# EAGLE design kicik-down (EAGLE 7.2.0)
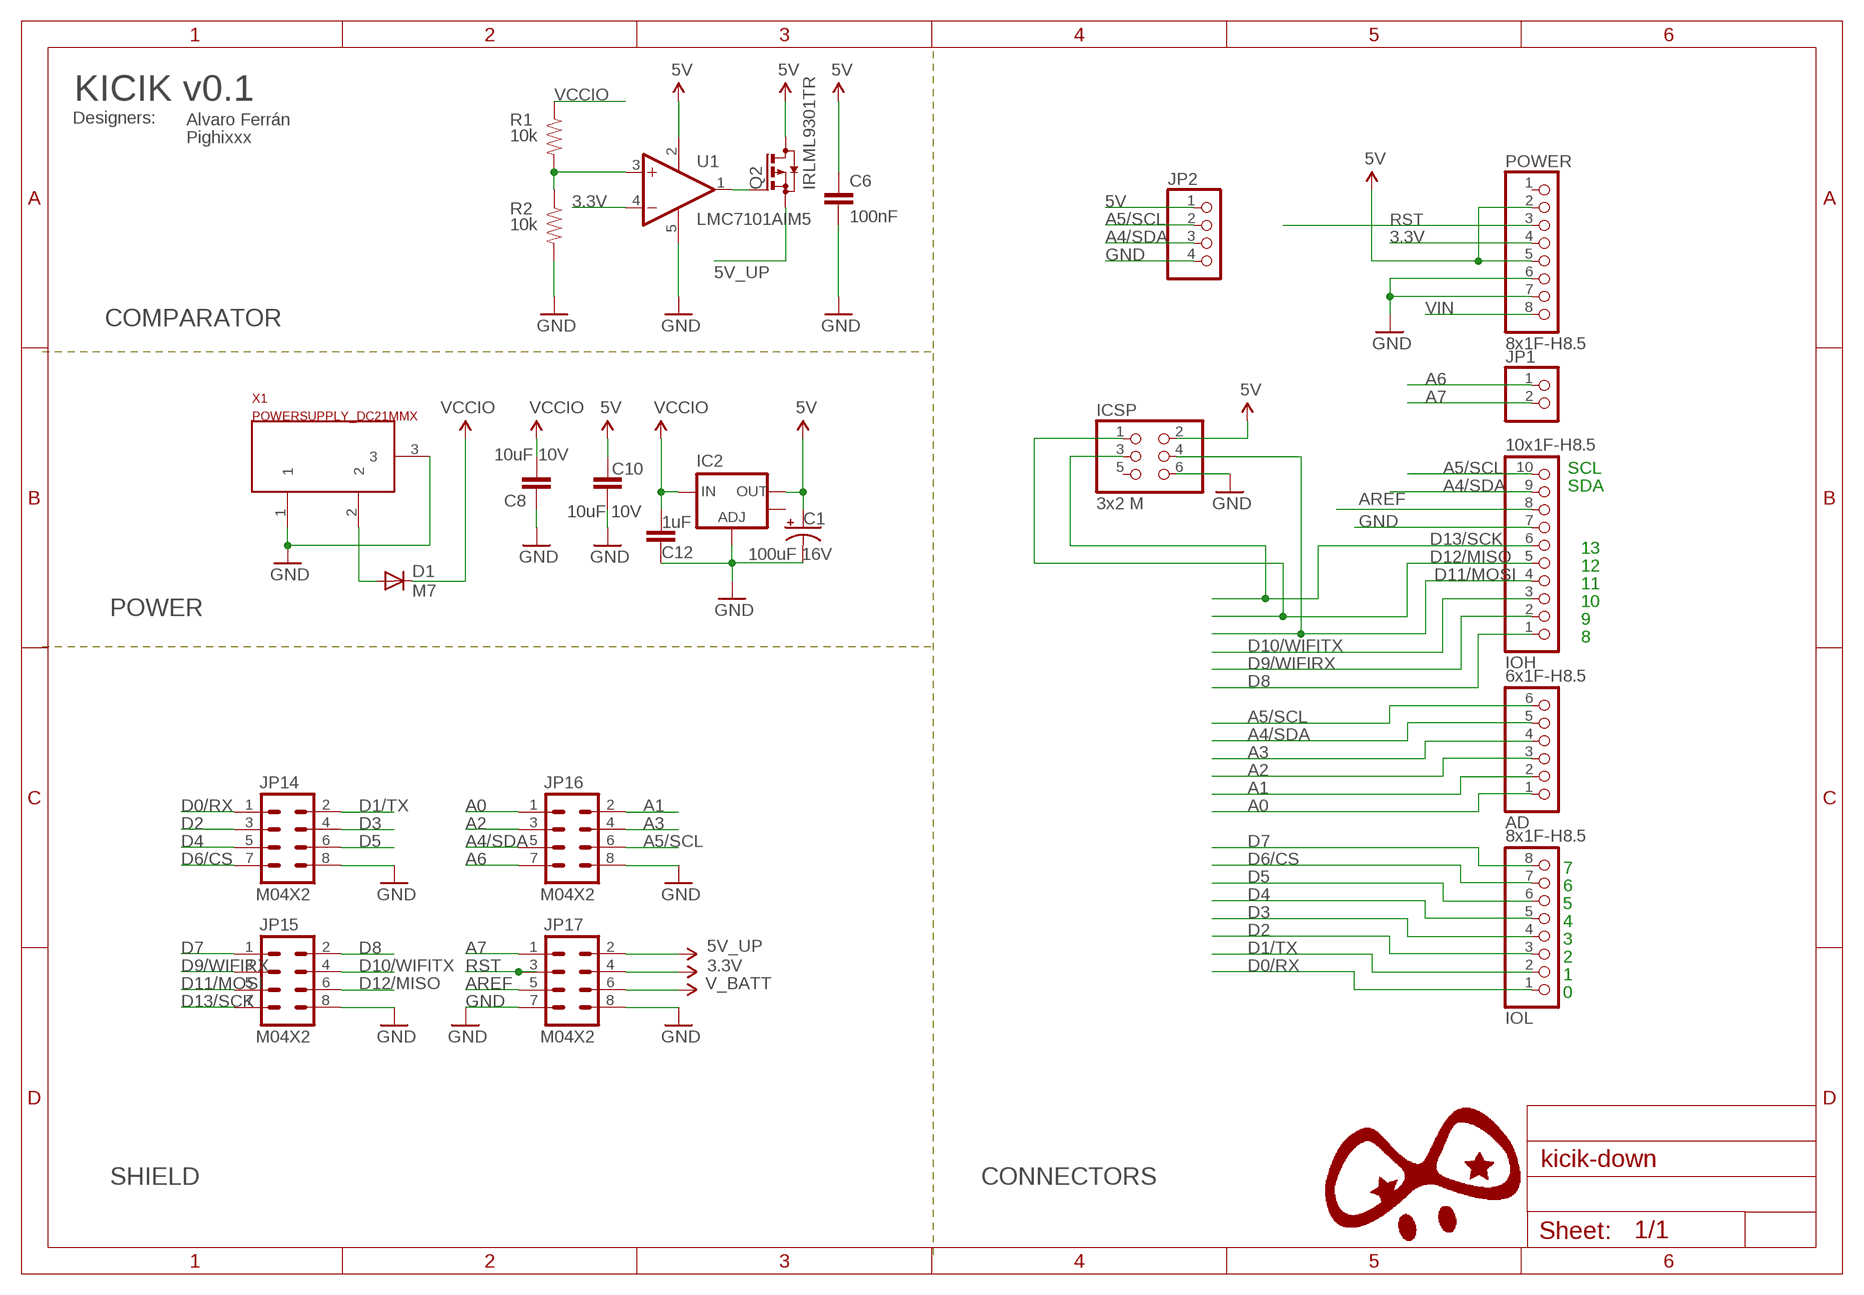
[diagram p0: schematic, sheet 1]

## Parts
AD  6x1F-H8.5  PINHD-1X6  [1X06]
C1  100uF 16V  CAP_POLC  [PANASONIC_C]
C6  100nF  CAP0402-CAP  [0402-CAP]
C8  10uF 10V  CAP0402-CAP  [0402-CAP]
C10  10uF 10V  CAP0402-CAP  [0402-CAP]
C12  1uF  CAP0402-CAP  [0402-CAP]
D1  M7  DIODE-SMB  [SMB]
IC2  V_REG_LM1117SOT223  [SOT223]
ICSP  3x2 M  PINHD-2X3  [2X03]
IOH  10x1F-H8.5  PINHD-1X10  [1X10]
IOL  8x1F-H8.5  PINHD-1X8  [1X08]
JP1  PINHD-1X2  [1X02]
JP2  PINHD-1X4  [1X04]
JP14  M04X2  [2X4]
JP15  M04X2  [2X4]
JP16  M04X2  [2X4]
JP17  M04X2  [2X4]
POWER  8x1F-H8.5  PINHD-1X8  [1X08]
Q2  IRLML9301TR  BSS84  [SOT23]
R1  10k  RESISTOR0402-RES  [0402-RES]
R2  10k  RESISTOR0402-RES  [0402-RES]
U1  LMC7101AIM5  [SOT23-5]
X1  POWERSUPPLY_DC21MMX  [POWERSUPPLY_DC-21MM]

## Nets
3.3V: JP17.4 POWER.4 U1.4(-IN)
5V: C1.+ C6.1 C10.2 IC2.2(OUT) ICSP.2 JP2.1 POWER.2 POWER.5 Q2.3(D) U1.2(V+)
5V_UP: JP17.2 Q2.2(S) ; supply symbol labelled VCC
A0: AD.1 JP16.1
A1: AD.2 JP16.2
A2: AD.3 JP16.3
A3: AD.4 JP16.4
A4/SDA: AD.5 IOH.9 JP2.3 JP16.5
A5/SCL: AD.6 IOH.10 JP2.2 JP16.6
A6: JP1.1 JP16.7
A7: JP1.2 JP17.1
AREF [aref]: IOH.8 JP17.5
D0/RX: IOL.1 JP14.1
D1/TX: IOL.2 JP14.2
D2: IOL.3 JP14.3
D3: IOL.4 JP14.4
D4: IOL.5 JP14.5
D5: IOL.6 JP14.6
D6/CS: IOL.7 JP14.7
D7: IOL.8 JP15.1
D8: IOH.1 JP15.2
D9/WIFIRX: IOH.2 JP15.3
D10/WIFITX: IOH.3 JP15.4
D11/MOSI: ICSP.4 IOH.4 JP15.5
D12/MISO: ICSP.1 IOH.5 JP15.6
D13/SCK: ICSP.3 IOH.6 JP15.7
GND [gnd]: C1.- C6.2 C8.1 C10.1 C12.1 IC2.1(ADJ) ICSP.6 IOH.7 JP2.4 JP14.8 JP15.8 JP16.8 JP17.7 JP17.8 POWER.6 POWER.7 R2.2 U1.5(V-) X1.1 X1.3
N$4: D1.A X1.2
N$5: Q2.1(G) U1.1(OUT)
N$6: R1.2 R2.1 U1.3(+IN)
RST: JP17.3 POWER.3
V_BATT: JP17.6
VCCIO [power]: C8.2 C12.2 D1.C IC2.3(IN) R1.1
VIN [power]: POWER.8
Unconnected: IC2.4(OUT) ICSP.5 POWER.1

## Notes on the sheet
- KICIK v0.1
- Designers: | Alvaro Ferrán
- Pighixxx
- COMPARATOR
- SCL
- SDA
- 13
- 12
- 11
- 10
- POWER
- 9
- 8
- 7
- 6
- 5
- 4
- 3
- 5V_UP
- 2
- 1
- 0
- SHIELD | CONNECTORS

## Library data of the parts
AD = SmartPrj:PINHD-1X6: PIN HEADER
C1 = SparkFun-Capacitors:CAP_POL: Capacitor Polarized These are standard SMD and PTH capacitors. Normally 10uF, 47uF, and 100uF in electrolytic and tantalum varieties. Always verify the external diameter of the through hole cap, it varies with capacity, voltage, and manufacturer. The EIA devices should be standard.
C6 C8 C10 C12 = SparkFun-Passives:CAP: Capacitor Standard 0603 ceramic capacitor, and 0.1" leaded capacitor.
D1 = diode:DIODE-: DIODE
IC2 = SparkFun-PowerIC:V_REG_LM1117: Voltage Regulator LM1117 Standard adjustable voltage regulator but in SMD form. Spark Fun Electronics SKU : COM-00595; PROD_ID: VREG-08170
ICSP = SmartPrj:PINHD-2X3: PIN HEADER
IOH = pinhead:PINHD-1X10: PIN HEADER
IOL POWER = SmartPrj:PINHD-1X8: PIN HEADER
JP1 = pinhead:PINHD-1X2: PIN HEADER
JP2 = pinhead:PINHD-1X4: PIN HEADER
JP14-JP17 = SparkFun-Connectors:M04X2: .1" header, two rows of four.
Q2 = transistor-small-signal:BSS84: P-CHANNEL MOS FET
R1 R2 = SparkFun-Passives:RESISTOR: Resistor Basic schematic elements and footprints for 0603, 1206, and PTH resistors.
U1 = linear:LMC7101AIM5
X1 = SmartPrj:POWERSUPPLY_DC21MM

## Net classes
0 default: width 0.254 mm, drill 0.254 mm, clearance 0.203 mm
1 power: width 0.61 mm, drill 0.61 mm, clearance 0.254 mm
2 gnd: width 0.305 mm, drill 0.559 mm, clearance 0.254 mm
3 usbvcc: width 0.508 mm, drill 0.61 mm, clearance 0.254 mm
4 aref: width 0.406 mm, drill 0.61 mm, clearance 0.254 mm

## Board
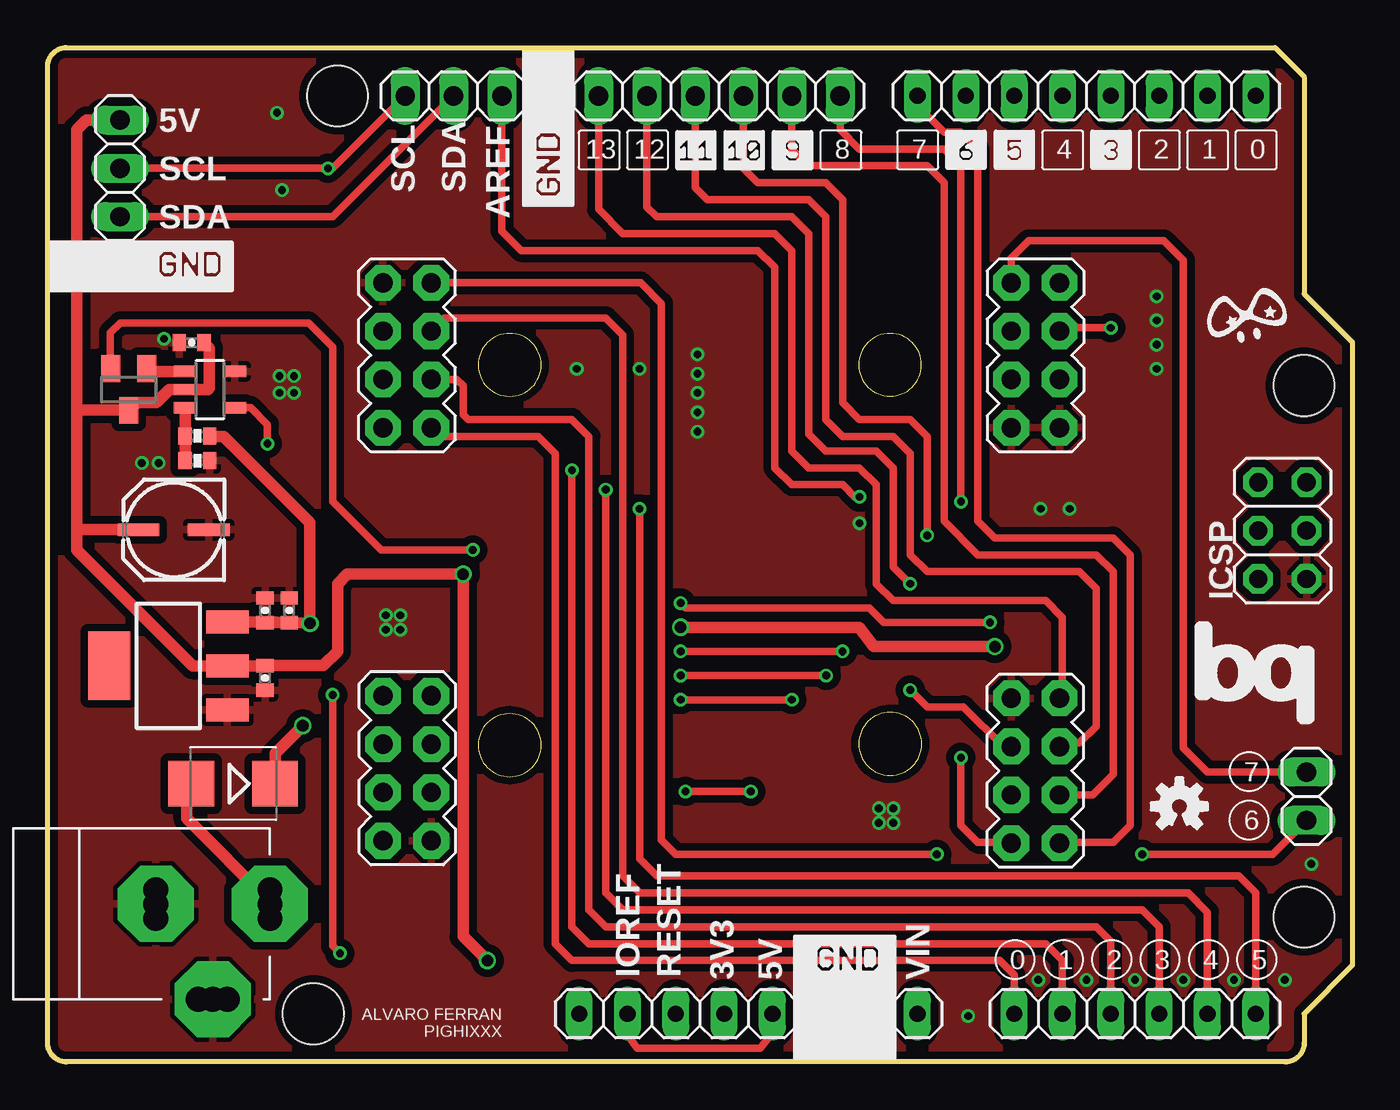
[diagram p1: board, top side]
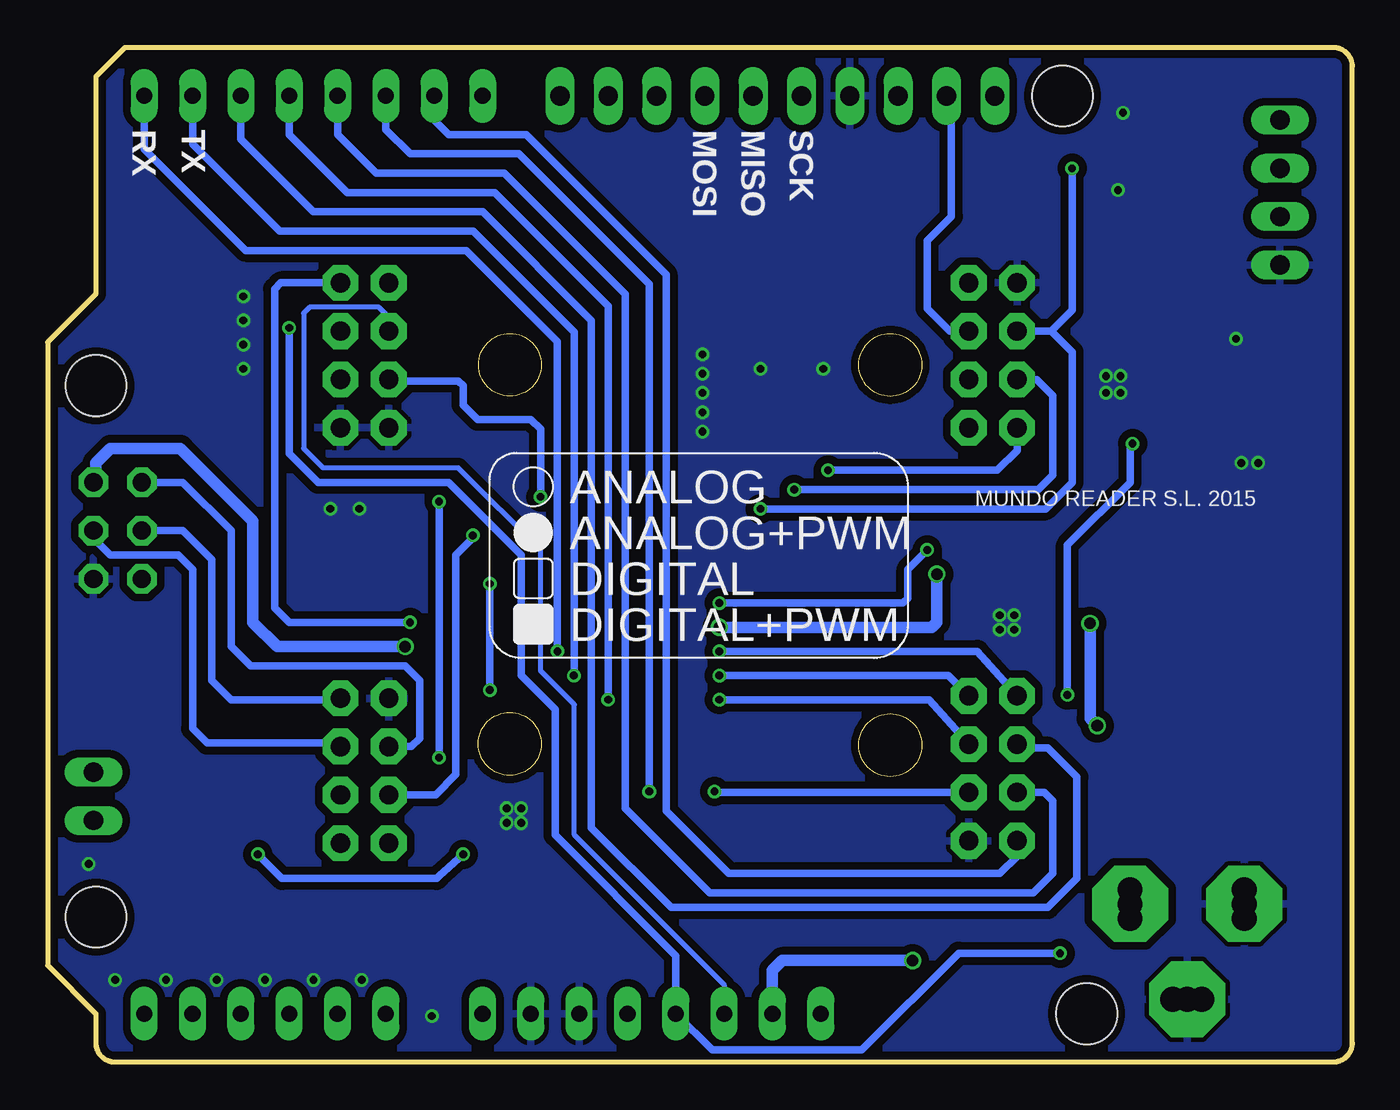
[diagram p2: board, bottom side, seen from below]

Size 68.58 x 53.34 mm. Coordinates in mm from the lower left corner, seen from the top.
Outline: 64.52,53.34 66.04,51.82 66.04,40.39 68.58,37.85 68.58,5.08 66.04,2.54 66.04,1 arc-90 65.04,0 1,0 arc-90 0,1 0,52.34 arc-90 1,53.34 64.52,53.34
Outline: 25.94,36.65 arc180 22.63,36.65 arc180 25.94,36.65
Outline: 45.93,36.66 arc180 42.63,36.66 arc180 45.93,36.66
Outline: 45.95,16.73 arc180 42.63,16.73 arc180 45.95,16.73
Outline: 25.95,16.66 arc180 22.63,16.66 arc180 25.95,16.66
Copper layers (1*16): Top 0.035mm / dielectric 1.5mm / Bottom 0.035mm
Design rules "pighixxx_CAM_DRC_V1.0": minimum track width 6mil, minimum drill 12mil, track to track 6mil, track to pad 6mil, pad to pad 6mil, via to via 6mil, smd to smd 0mil, copper to edge 10mil, drill to drill 10mil, minimum pad ring 10mil, minimum via ring 6mil, stop-mask expansion 2mil, vias tented up to drill 100mil, thermal gap 10mil
Holes 3.2 mm at 66.04,35.56 66.04,7.62 15.24,50.8 13.97,2.54
vRestrict: area 47.9,10.3 to 48.5,10.8; area 50.4,10.2 to 50.9,11

### Footprints (pad centres in the part's own frame; a part is rotated, then mirrored left to right if it is on the bottom)
1X06 = drill 0.85 pad 1.422 long: 1 -6.35,0; 2 -3.81,0; 3 -1.27,0; 4 1.27,0; 5 3.81,0; 6 6.35,0
PANASONIC_C = smd 2.2 x 0.65: + 1.9,-0.2; - -1.8,-0.2
0402-CAP = smd 0.7 x 0.9: 1 -0.65,0; 2 0.65,0
SMB = smd 2.4 x 2.4: A 2.2,0; C -2.2,0
SOT223 = smd 1.219 x 2.235: 1 -2.311,-3.099; 2 0,-3.099; 3 2.311,-3.099 | smd 3.6 x 2.2: 4 0,3.099
2X03 = drill 0.95 pad 1.55 octagon: 1 -2.54,-1.27; 2 -2.54,1.27; 3 0,-1.27; 4 0,1.27; 5 2.54,-1.27; 6 2.54,1.27
1X10 = drill 1.016 long: 1 -11.43,0; 2 -8.89,0; 3 -6.35,0; 4 -3.81,0; 5 -1.27,0; 6 1.27,0; 7 3.81,0; 8 6.35,0; 9 8.89,0; 10 11.43,0
1X08 = drill 0.85 pad 1.422 long: 1 -8.89,0; 2 -6.35,0; 3 -3.81,0; 4 -1.27,0; 5 1.27,0; 6 3.81,0; 7 6.35,0; 8 8.89,0
1X02 = drill 1.016 long: 1 -1.27,0; 2 1.27,0
1X04 = drill 1.016 long: 1 -3.81,0; 2 -1.27,0; 3 1.27,0; 4 3.81,0
2X4 = drill 1.016 pad 1.88 octagon: 1 -3.81,-1.27; 2 -3.81,1.27; 3 -1.27,-1.27; 4 -1.27,1.27; 5 1.27,-1.27; 6 1.27,1.27; 7 3.81,-1.27; 8 3.81,1.27
SOT23 = smd 1 x 1.4: 1 -0.95,-1.1; 2 0.95,-1.1; 3 0,1.1
0402-RES = smd 0.7 x 0.9: 1 -0.65,0; 2 0.65,0
SOT23-5 = smd 0.6 x 1.2: 1 -0.95,-1.306; 2 0,-1.306; 3 0.95,-1.306; 4 0.95,1.306; 5 -0.95,1.306
POWERSUPPLY_DC-21MM = drill 1.3 pad 4 octagon: 1 -5.08,-3.353; 2 -0.076,-6.35; 3 -0.076,-0.356 | drill 1.3: 4 -5.08,-4.115; 5 -5.08,-2.591; 6 -0.838,-0.356; 7 0.686,-0.356; 8 -0.838,-6.35; 9 0.686,-6.35

### Placement (x,y rotation side)
AD  57.15,2.54 0 top
C1  6.68,27.79 180 top
C6  7.57,37.82 180 top
C8  11.43,23.75 270 top
C10  11.43,20.19 90 top
C12  12.7,23.75 270 top
D1  9.75,14.63 180 top
IC2  6.35,20.83 90 top
ICSP  64.9,27.94 270 top
IOH  30.23,50.8 180 top
IOL  54.61,50.8 180 top
JP1  66.17,13.97 90 top
JP2  3.81,45.72 270 top
JP14  18.9,15.44 270 top
JP15  51.92,15.32 90 top
JP16  18.9,37.16 90 top
JP17  51.92,37.16 270 top
LOGO3  OSHW-LOGOS  [OSHW-LOGO-S]  59.49,13.44 0 top
POWER  36.83,2.54 0 top
Q2  4.27,35.36 180 top
R1  7.87,32.92 180 top
R2  7.87,31.62 0 top
U1  8.53,35.36 270 top
U$1  [BQ_LOGO]  60.3,17.78 0 top
U$2  [PIGHIXXX_LOGO]  60.96,37.85 0 top
U$3  [S_KICIK_GND_1]  -0.13,40.26 0 top
U$4  [S_KICIK_GND_2]  24.43,44.98 0 top
U$5  [S_0_P]  62.38,46.89 0 top
U$6  [S_1_P]  59.84,46.89 0 top
U$7  [S_2_P]  57.3,46.89 0 top
U$8  [S_3]  54.91,47.02 0 top
U$9  [S_4_P]  52.22,46.89 0 top
U$10  [S_5]  49.83,47.02 0 top
U$11  [S_6]  47.29,47.02 0 top
U$12  [S_7_P]  44.6,46.89 0 top
U$13  [S_8_P]  40.56,46.89 0 top
U$14  [S_9]  38.18,46.99 0 top
U$15  [S_10]  35.64,46.99 0 top
U$16  [S_11]  33.1,46.99 0 top
U$17  [S_12_P]  30.4,46.89 0 top
U$18  [S_13_P]  27.86,46.89 0 top
U$19  [S_0_R_P]  49.78,4.32 0 top
U$20  [S_1_R_P]  52.32,4.32 0 top
U$21  [S_2_R_P]  54.86,4.32 0 top
U$22  [S_3_R_P]  57.4,4.32 0 top
U$23  [S_4_R_P]  59.94,4.32 0 top
U$24  [S_5_R_P]  62.48,4.32 0 top
U$25  [S_6_R_P]  62.08,11.66 0 top
U$26  [S_7_R_P]  62.08,14.2 0 top
U$27  [S_KICIK_GND_3]  39.14,-0.08 0 top
U$28  [S_LEGEND]  45.47,21.11 0 bottom
X1  5.33,8.38 90 top

### Tracks (layer width: path | path; a pad name or v marks a point on that pad's centre or on a via)
3.3V  (via drill 0.41)
  Top 0.406: v55.88,38.61 53.37,38.61 JP17.4 | v15.37,5.71 14.99,6.1 v14.99,19.3 | v11.56,32.51 11.56,33.53 10.67,34.42 9.85,34.42 U1.4
  Bottom 0.406: v55.88,38.61 55.88,32 54.36,30.48 47.5,30.48 43.69,26.67 43.69,20.32 41.91,18.54 41.91,11.94 35.56,5.59 POWER.4 33.66,0.64 25.78,0.64 20.7,5.71 v15.37,5.71 | v14.99,19.3 14.99,27.18 11.68,30.48 11.68,32.38 v11.56,32.51
5V  (via drill 0.6)
  Top 0.406: POWER.5 38.1,1.52 37.47,0.71 30.99,0.71 30.48,1.4 POWER.2 | 1.52,27.99 1.52,28.04
  Top 0.61: JP2.1 2.03,49.53 1.52,49.02 1.52,34.29 | 1.52,34.29 1.52,28.04 | v33.27,22.86 42.67,22.86 43.43,21.84 v49.78,21.84 | v23.11,5.33 21.84,6.6 v21.84,25.65 15.75,25.65 15.24,25.15 15.24,21.59 14.49,20.84 C10.2 11.41,20.83 IC2.2 7.62,20.83 1.52,26.92 1.52,27.99 C1.+ | C6.1 8.51,37.53 8.51,35.43 8.43,35.36 U1.2 6.4,35.36 5.71,34.67 4.68,34.67 Q2.3 4.23,34.29 1.52,34.29
  Bottom 0.61: ICSP.2 66.04,30.61 66.04,31.5 65.28,32.26 61.59,32.26 57.78,28.45 57.78,23.11 56.52,21.84 v49.78,21.84 | v21.84,25.65 21.84,23.11 22.1,22.86 v33.27,22.86 | v23.11,5.33 29.97,5.33 30.48,4.83 POWER.2
5V_UP  (via drill 0.41)
  Top 0.406: v49.53,23.11 43.94,23.11 43.18,23.88 33.53,23.88 v33.27,24.13 | v22.35,26.92 17.53,26.92 14.99,29.46 14.99,37.59 13.72,38.86 3.81,38.86 3.3,38.35 3.3,36.47 Q2.2
  Bottom 0.406: JP17.2 56.31,40.97 56.64,40.64 56.64,23.88 55.88,23.11 v49.53,23.11 | v33.27,24.13 23.62,24.13 23.37,24.38 23.37,25.91 v22.35,26.92
A0
  Top 0.406: AD.1 50.8,4.57 50.04,5.33 27.56,5.33 26.67,6.22 26.67,32 25.78,32.89 20.62,32.89 JP16.1
A1  (via drill 0.41)
  Top 0.406: AD.2 53.34,5.33 52.45,6.22 28.45,6.22 27.56,7.11 v27.56,31.11
  Bottom 0.406: v27.56,31.11 18.67,31.11 17.63,32.16 JP16.2
A2
  Top 0.406: AD.3 55.88,6.35 55.12,7.11 29.34,7.11 28.45,8 28.45,32.89 27.56,33.78 22.1,33.78 21.84,34.04 21.84,35.56 21.51,35.89 JP16.3
A3  (via drill 0.41)
  Top 0.406: AD.4 58.42,7.11 57.53,8 30.23,8 29.34,8.89 v29.34,30.1
  Bottom 0.406: v29.34,30.1 16.51,30.1 15.75,30.86 15.75,35.05 16.59,35.89 JP16.4
A4/SDA
  Top 0.406: IOH.9 14.99,44.45 JP2.3 | AD.5 60.96,7.87 59.94,8.89 31.11,8.89 30.23,9.78 30.23,38.23 29.34,39.12 20.85,39.12 JP16.5
  Bottom 0.406: JP16.5 21.16,38.43 22.35,39.62 22.35,43.18 21.08,44.45 21.08,50.55 IOH.9
A5/SCL  (via drill 0.41)
  Top 0.406: IOH.10 14.99,46.99 v14.73,46.99 JP2.2 | AD.6 63.5,8.89 62.61,9.78 32,9.78 31.11,10.67 v31.11,29.08
  Bottom 0.406: v31.11,29.08 16.13,29.08 14.73,30.48 14.73,37.34 15.82,38.43 | 15.82,38.43 JP16.6 | 15.82,38.43 14.73,39.52 v14.73,46.99
A6  (via drill 0.41)
  Top 0.406: JP16.7 31.17,40.97 32.26,39.88 32.26,11.68 33.02,10.92 v46.74,10.92 | v57.53,10.92 64.39,10.92 JP1.1
  Bottom 0.406: v46.74,10.92 48.01,9.78 48.13,9.65 56.26,9.65 v57.53,10.92
A7
  Top 0.406: JP17.1 50.65,42.27 51.56,43.18 58.67,43.18 59.69,42.16 59.69,16.51 60.96,15.24 JP1.2
AREF  (via drill 0.41)
  Top 0.406: IOH.8 23.88,43.69 24.89,42.67 37.34,42.67 38.23,41.78 38.23,31.24 39.12,30.35 41.78,30.35 42.42,29.72 v42.67,29.72
  Bottom 0.406: v42.67,29.72 42.67,33.27 43.18,33.78 45.97,33.78 46.74,34.54 46.74,35.56 46.99,35.81 50.57,35.81 JP17.5
D0/RX  (via drill 0.41)
  Top 0.406: v41.78,21.59 v33.27,21.59
  Bottom 0.406: IOL.1 63.5,48.01 58.17,42.67 46.58,42.67 41.78,37.87 v41.78,21.59 | v33.27,21.59 19.71,21.59 JP14.1
D1/TX  (via drill 0.41)
  Top 0.406: v40.92,20.32 v33.27,20.32
  Bottom 0.406: IOL.2 60.96,48.26 56.39,43.69 46.2,43.69 40.89,38.38 40.89,20.68 v40.92,20.32 | v33.27,20.32 21.23,20.32 JP14.2
D2
  Bottom 0.406: IOL.3 58.42,48.51 54.61,44.7 45.72,44.7 40.01,38.99 40.01,12.32 35.81,8.13 16,8.13 14.48,9.65 14.48,14.99 16,16.51 17.42,16.51 JP14.3
D3  (via drill 0.41)
  Top 0.406: v39.12,19.05 v33.27,19.05
  Bottom 0.406: IOL.4 55.88,48.77 52.83,45.72 45.09,45.72 39.12,39.75 v39.12,19.05 | JP14.4 22.25,19.05 v33.27,19.05
D4
  Bottom 0.406: IOL.5 53.34,48.77 51.31,46.74 44.58,46.74 38.23,40.39 38.23,13.34 33.78,8.89 16.76,8.89 15.75,9.91 15.75,13.72 16.2,14.17 JP14.5
D5  (via drill 0.41)
  Top 0.406: v36.96,14.22 v33.53,14.22
  Bottom 0.406: IOL.6 50.8,49.02 49.53,47.75 43.81,47.75 36.96,40.89 v36.96,14.22 | v33.53,14.22 33.48,14.17 JP14.6
D6/CS
  Bottom 0.406: IOL.7 48.26,49.53 47.5,48.77 43.43,48.77 36.07,41.4 36.07,13.21 32.77,9.91 18.54,9.91 17.63,10.82 JP14.7
D7
  Top 0.406: IOL.8 45.72,50.29 47.12,48.9 48.01,48.9 48.9,48.01 48.9,28.45 49.78,27.56 56.01,27.56 56.9,26.67 56.9,12.45 56.01,11.56 53.24,11.56 JP15.1
D8  (via drill 0.41)
  Top 0.406: IOH.1 41.66,49.02 42.67,48.01 47.12,48.01 48.01,47.12 v48.01,29.46 | v48.01,16 48.01,12.45 48.9,11.56 50.6,11.56 JP15.2
  Bottom 0.406: v48.01,29.46 v48.01,16
D9/WIFIRX
  Top 0.406: IOH.2 39.12,48.01 40.01,47.12 46.23,47.12 47.12,46.23 47.12,28.45 48.9,26.67 55.12,26.67 56.01,25.78 56.01,15.11 54.94,14.05 JP15.3
D10/WIFITX  (via drill 0.41)
  Top 0.406: IOH.3 36.58,46.99 37.34,46.23 40.89,46.23 41.78,45.34 41.78,34.67 42.67,33.78 45.34,33.78 46.23,32.89 v46.23,27.69
  Bottom 0.406: v46.23,27.69 46.23,27.56 47.12,26.67 47.12,15.11 48.18,14.05 JP15.4
D11/MOSI
  Top 0.406: IOH.4 34.04,45.97 34.67,45.34 40.01,45.34 40.89,44.45 40.89,33.78 41.78,32.89 44.45,32.89 45.34,32 45.34,26.67 46.23,25.78 54.23,25.78 55.12,24.89 55.12,17.65 54.23,16.76 53.37,16.76 JP15.5
  Bottom 0.406: ICSP.4 66.17,27.56 65.28,26.67 61.72,26.67 60.96,25.91 60.96,17.53 60.2,16.76 53.37,16.76 JP15.5
D12/MISO  (via drill 0.41)
  Top 0.406: IOH.5 31.5,44.96 32,44.45 39.12,44.45 40.01,43.56 40.01,33.02 40.89,32.13 43.56,32.13 44.45,31.24 44.45,26.04 v45.34,25.15 | v45.34,19.56 46.23,18.67 48.13,18.67 50.22,16.59 JP15.6
  Bottom 0.406: ICSP.1 61.47,30.48 58.93,27.94 58.93,21.84 57.91,20.83 49.78,20.83 49.02,20.07 49.02,17.02 49.45,16.59 JP15.6 | v45.34,25.15 v45.34,19.56
D13/SCK
  Top 0.406: IOH.6 28.96,44.83 30.23,43.56 38.23,43.56 39.12,42.67 39.12,32.13 40.01,31.24 42.67,31.24 43.56,30.35 43.56,25.15 44.45,24.26 52.45,24.26 53.34,23.37 53.34,19.28 JP15.7
  Bottom 0.406: ICSP.3 61.47,27.94 59.94,26.42 59.94,20.07 58.93,19.05 53.26,19.05 JP15.7
GND  (via drill 0.41)
  other vias: 44.45,13.34 52.2,29.08 27.81,36.45 12.06,49.91 48.39,2.41 31.11,36.45 52.07,4.32 54.61,4.32 57.15,4.32 59.69,4.32 62.36,4.32 65.02,4.32 34.16,37.21 34.16,33.15 34.16,34.16 53.72,29.08 58.29,40.26 58.29,38.99 58.29,37.72 58.29,36.45 42.67,28.32 43.69,13.34 43.69,12.57 44.45,12.57 18.54,23.5 17.78,23.5 17.78,22.73 18.54,22.73 66.42,10.41 12.32,45.85 12.19,36.07 12.19,35.18 5.84,31.5 4.95,31.5 6.12,38.02 34.16,35.18 34.16,36.2 12.95,36.07 12.95,35.18
  pour Bottom (isolate 0.406, rank 2): 0.38,53.21 67.44,53.21 67.94,52.45 67.94,-0.13 0.89,-0.13 0.64,0.89
  pour Top (isolate 0.406, rank 2): 0.64,53.47 67.94,53.47 67.94,-0.13 0.64,-0.13
N$4
  Top 0.61: X1.2 11.68,8.43 7.32,12.8 7.32,14.39 D1.A
N$5
  Top 0.61: U1.1 5.37,36.31 Q2.1
N$6
  Top 0.61: U1.3 R1.2 R2.1
RST
  Bottom 0.254: JP17.3 50.65,39.22 50.7,39.22 51.18,39.7 54.79,39.7 55.12,39.37 55.12,32.26 54.1,31.24 46.99,31.24 42.67,26.92 42.67,20.57 40.89,18.8 40.89,11.94 33.02,4.06 POWER.3
VCCIO  (via drill 0.6, 0.61)
  Top 0.61: IC2.3 12,23.14 C8.2 C12.2 12.97,23.1 v13.79,23.06 13.79,28.37 9.27,32.89 8.55,32.89 R1.1 | D1.C 11.95,16.22 v13.41,17.68
  Bottom 0.61: v13.79,23.06 13.79,18.06 v13.41,17.68

### Text on the board
tPlace: 5V | SCL | SCL | SDA | SDA
bPlace: SCK | MISO | MOSI
tNames: AREF | IOREF | RESET | 3V3 | 5V | VIN | ALVARO FERRAN / PIGHIXXX
bNames: TX | RX | MUNDO READER S.L. 2015
214bmp: D:/SmartProjects/Snc/a4_bn_logo2.bmp